# EAGLE design Mono_Slider2 (EAGLE 7.5.0)
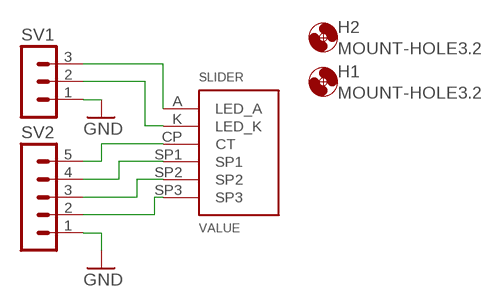
[diagram p0: schematic, sheet 1]

## Parts
H1  MOUNT-HOLE3.2  [3,2]
H2  MOUNT-HOLE3.2  [3,2]
SL1  SLIDER  SLIDERSLIDER_SMALL  [SLIDER_SMALL]
SV1  MA03-1  [MA03-1]
SV2  MA05-1  [MA05-1]

## Nets
A: SL1.A(LED_A) SV1.3
CP: SL1.CP(CT) SV2.5
GND: SV1.1 SV2.1
K: SL1.K(LED_K) SV1.2
SP1: SL1.SP1 SV2.4
SP2: SL1.SP2 SV2.3
SP3: SL1.SP3 SV2.2

## Library data of the parts
H1 H2 = holes:MOUNT-HOLE: MOUNTING HOLE with drill center marker
SL1 = SLIDER:SLIDER
SV1 = con-lstb:MA03-1: PIN HEADER; OC_FARNELL: unknown; OC_NEWARK: unknown
SV2 = con-lstb:MA05-1: PIN HEADER; OC_FARNELL: unknown; OC_NEWARK: unknown

## Board
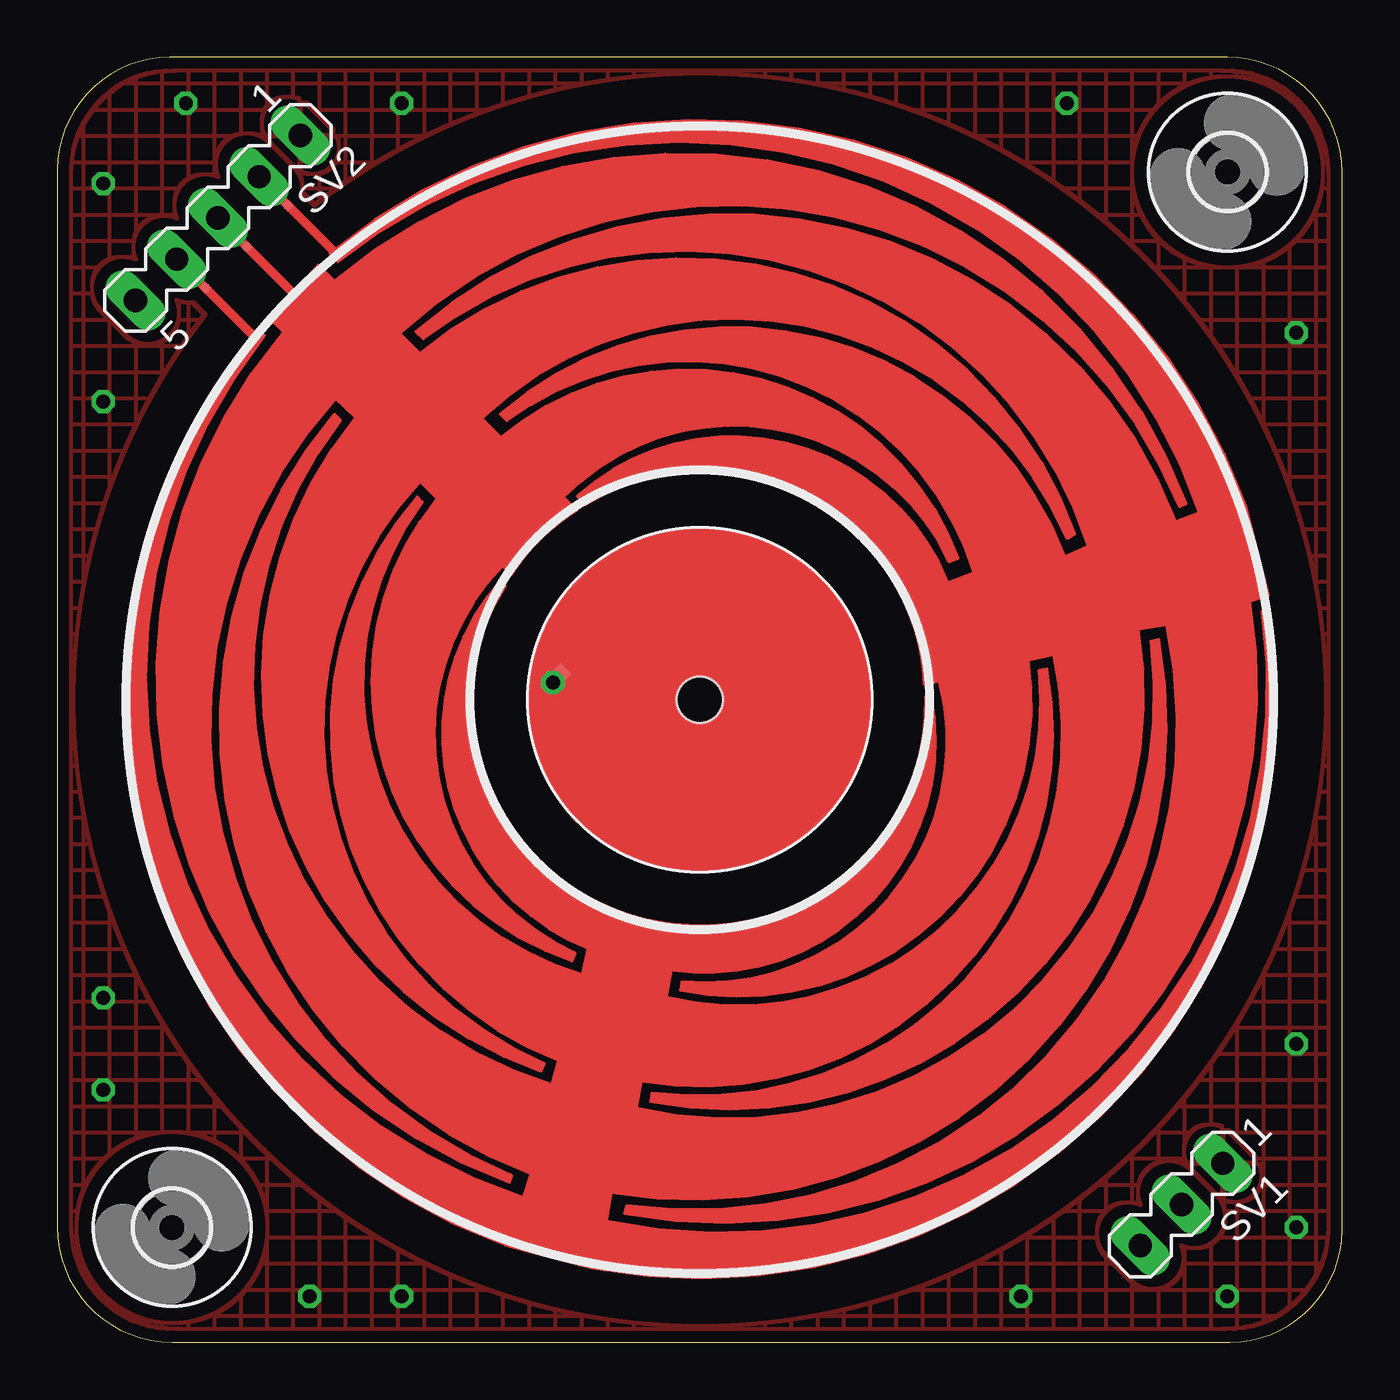
[diagram p1: board, top side]
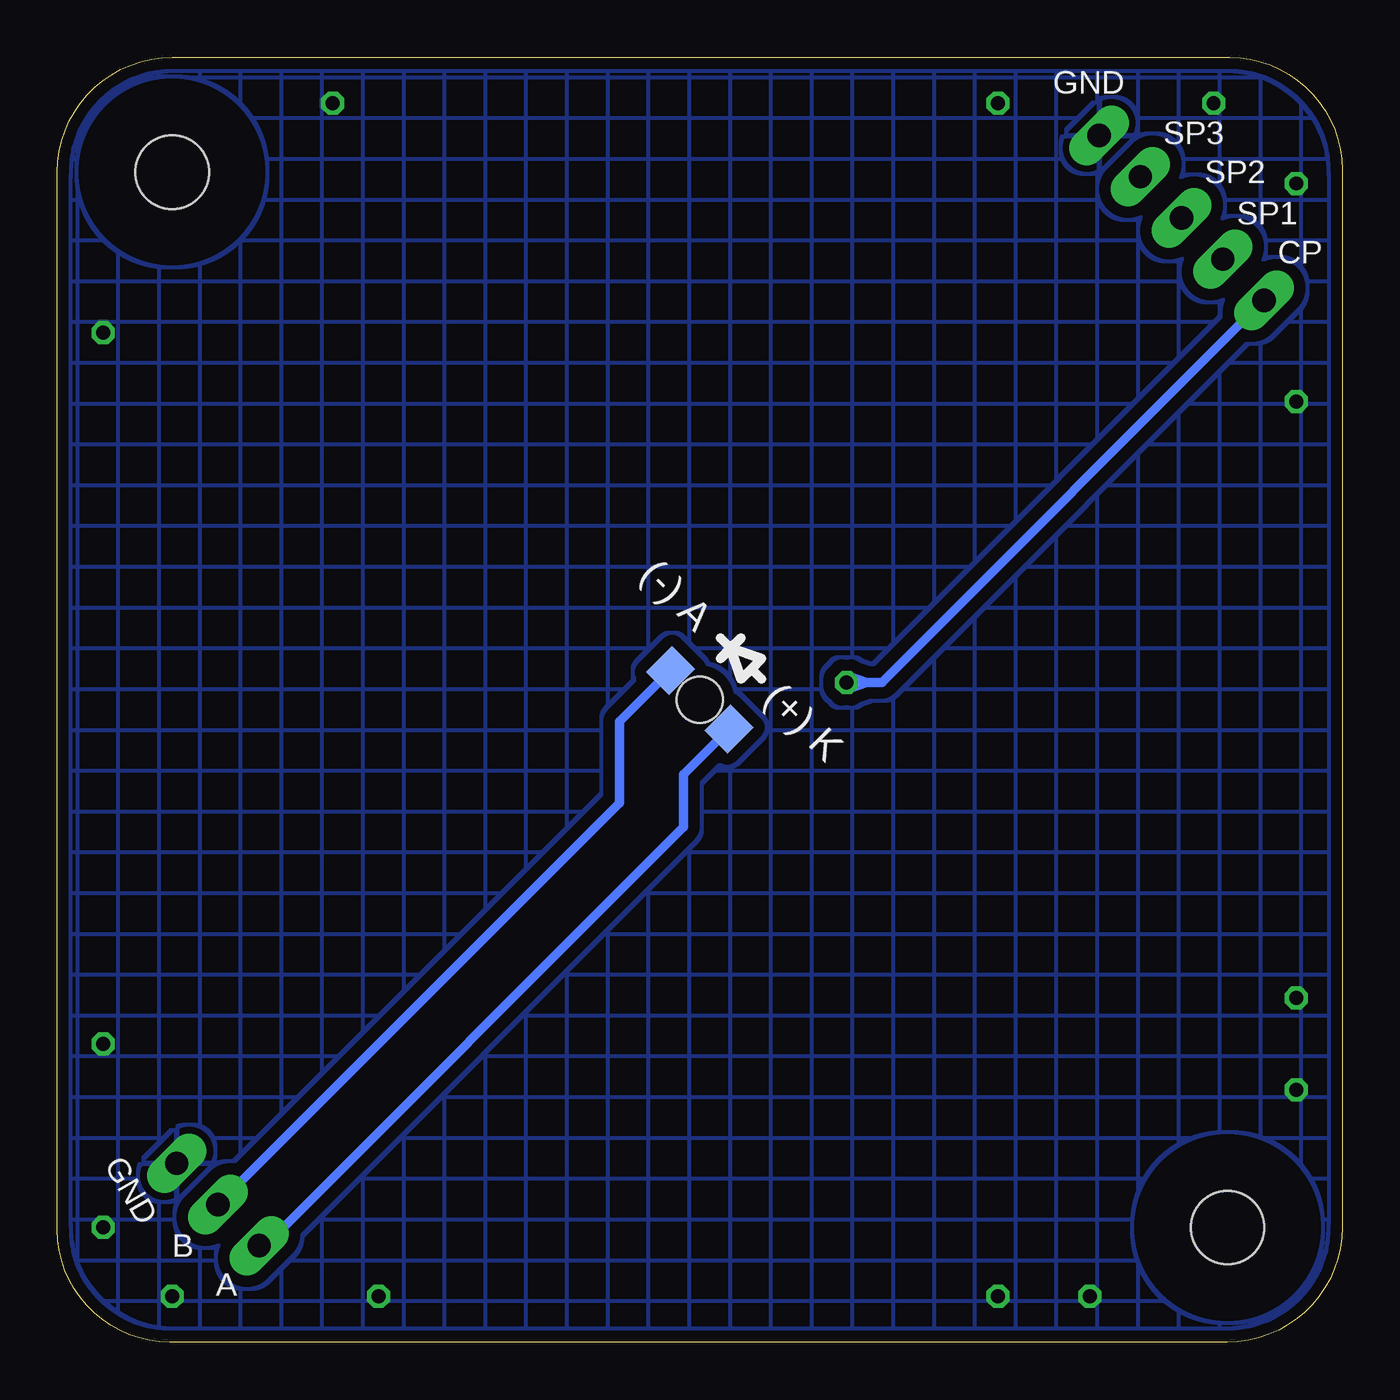
[diagram p2: board, bottom side, seen from below]

Size 56 x 56 mm. Coordinates in mm from the lower left corner, seen from the top.
Outline: 0,5 arc90 5,0 51.1,0 arc90 56,4.9 56,51 arc90 51,56 4.9,56 arc90 0,51.1 0,5
Copper layers (1*16): Top 0.035mm / dielectric 1.5mm / Bottom 0.035mm
Design rules "Mono_Slider *": minimum track width 10mil, minimum drill 24mil, track to track 0.5mm, track to pad 0.4mm, pad to pad 0.3mm, via to via 0.205mm, smd to smd 0.00761875mm, copper to edge 0.5mm, drill to drill 0.3mm, minimum pad ring 0.00761875mm, minimum via ring 8mil, stop-mask expansion 4mil, vias tented up to drill 0mil, thermal gap 0.3mm

### Footprints (pad centres in the part's own frame; a part is rotated, then mirrored left to right if it is on the bottom)
3,2 = hole 3.2: 0,0
SLIDER_SMALL = smd 1.4 x 1.6 bottom: A -1.8,0; K 1.8,0 | smd 1.27 x 0.635: CP -3.81,5.08 | smd 0.406 x 0.406: SP1 -2.54,27.94; SP2 0,27.94; SP3 2.54,27.94 | hole 2: 0,0
MA03-1 = drill 1.016 long: 1 -2.54,0; 2 0,0; 3 2.54,0
MA05-1 = drill 1.016 long: 1 -5.08,0; 2 -2.54,0; 3 0,0; 4 2.54,0; 5 5.08,0

### Placement (x,y rotation side)
H1  51,51 0 top
H2  5,5 0 top
SL1  28,28 45 top
SV1  49,6 225 top
SV2  7,49 225 top

### Tracks (layer width: path | path; a pad name or v marks a point on that pad's centre or on a via)
A
  Bottom 0.406: SL1.A 28.7,24.75 28.7,22.45 47.45,3.7 47.45,3.96 SV1.3
CP  (via drill 0.6)
  Top 0.406: SL1.CP 21.63,28.72 v21.6,28.75
  Bottom 0.406: v21.6,28.75 20.7,28.75 | 20.7,28.75 20.07,28.75 SV2.5 | 20.7,28.75 21.5,28.47 v21.6,28.75 | 20.7,28.75 21.5,29.03 v21.6,28.75
GND  (via drill 0.6)
  other vias: 44,54 54,44 54,13 54,5 51,2 42,2 15,2 11,2 2,11 2,15 2,41 2,50.5 5.6,54 15,54
  pour Top (hatched): 0,56 56,56 56,0 0,0
  pour Bottom (hatched): 0,56.1 56,56.1 56,0 0,0
K
  Bottom 0.406: SL1.K 31.5,27.05 31.5,23.5 SV1.2
SP1
  Top 0.406: SV2.4 SL1.SP1 6.57,45.84
SP2
  Top 0.406: SV2.3 8.36,47.64 SL1.SP2
SP3
  Top 0.406: SV2.2 SL1.SP3 10.16,49.43

### Text on the board
bPlace: GND | SP3 | SP2 | SP1 | CP | GND | B | A